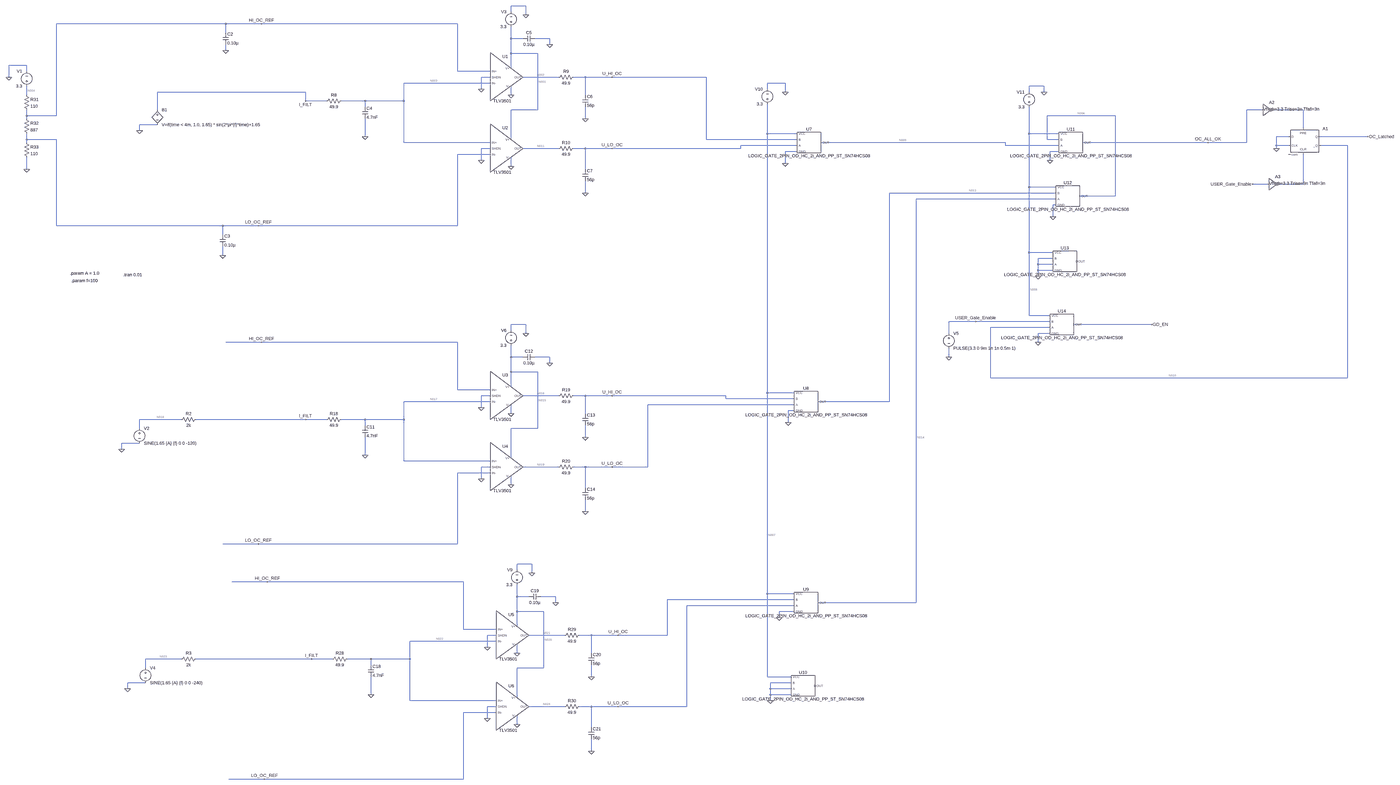
[diagram p0: schematic OvercurrentDetection.asc, whole sheet]
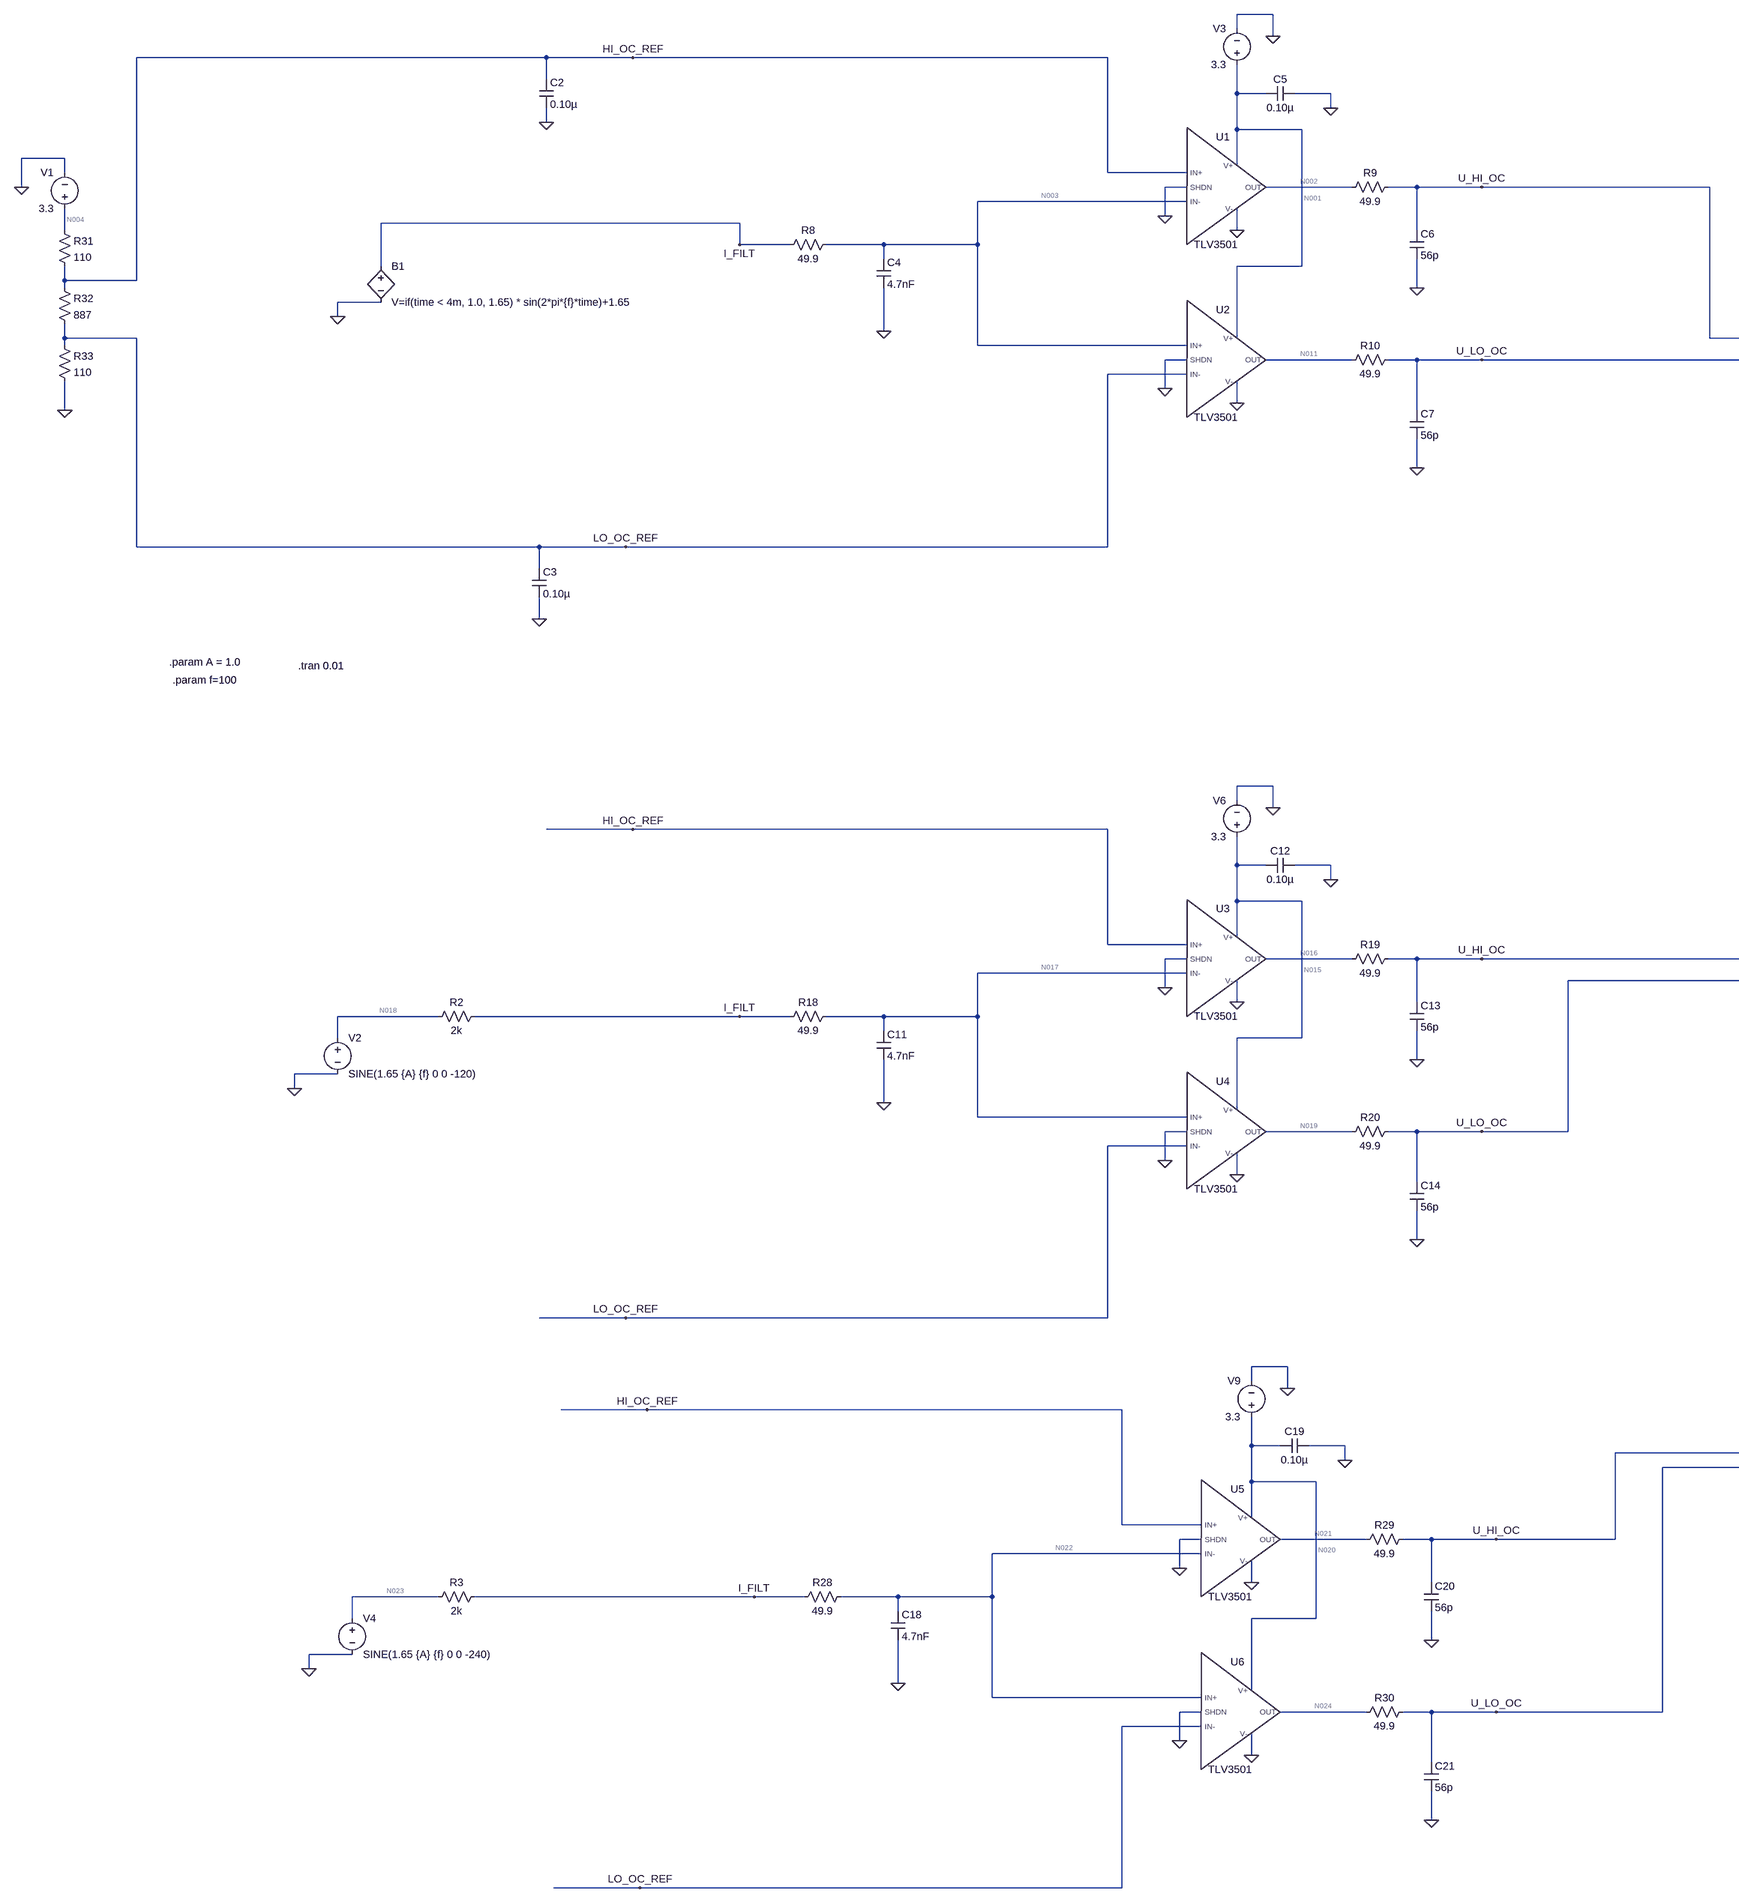
[diagram p1: schematic OvercurrentDetection.asc, part, row 1 of 1, column 1 of 2]
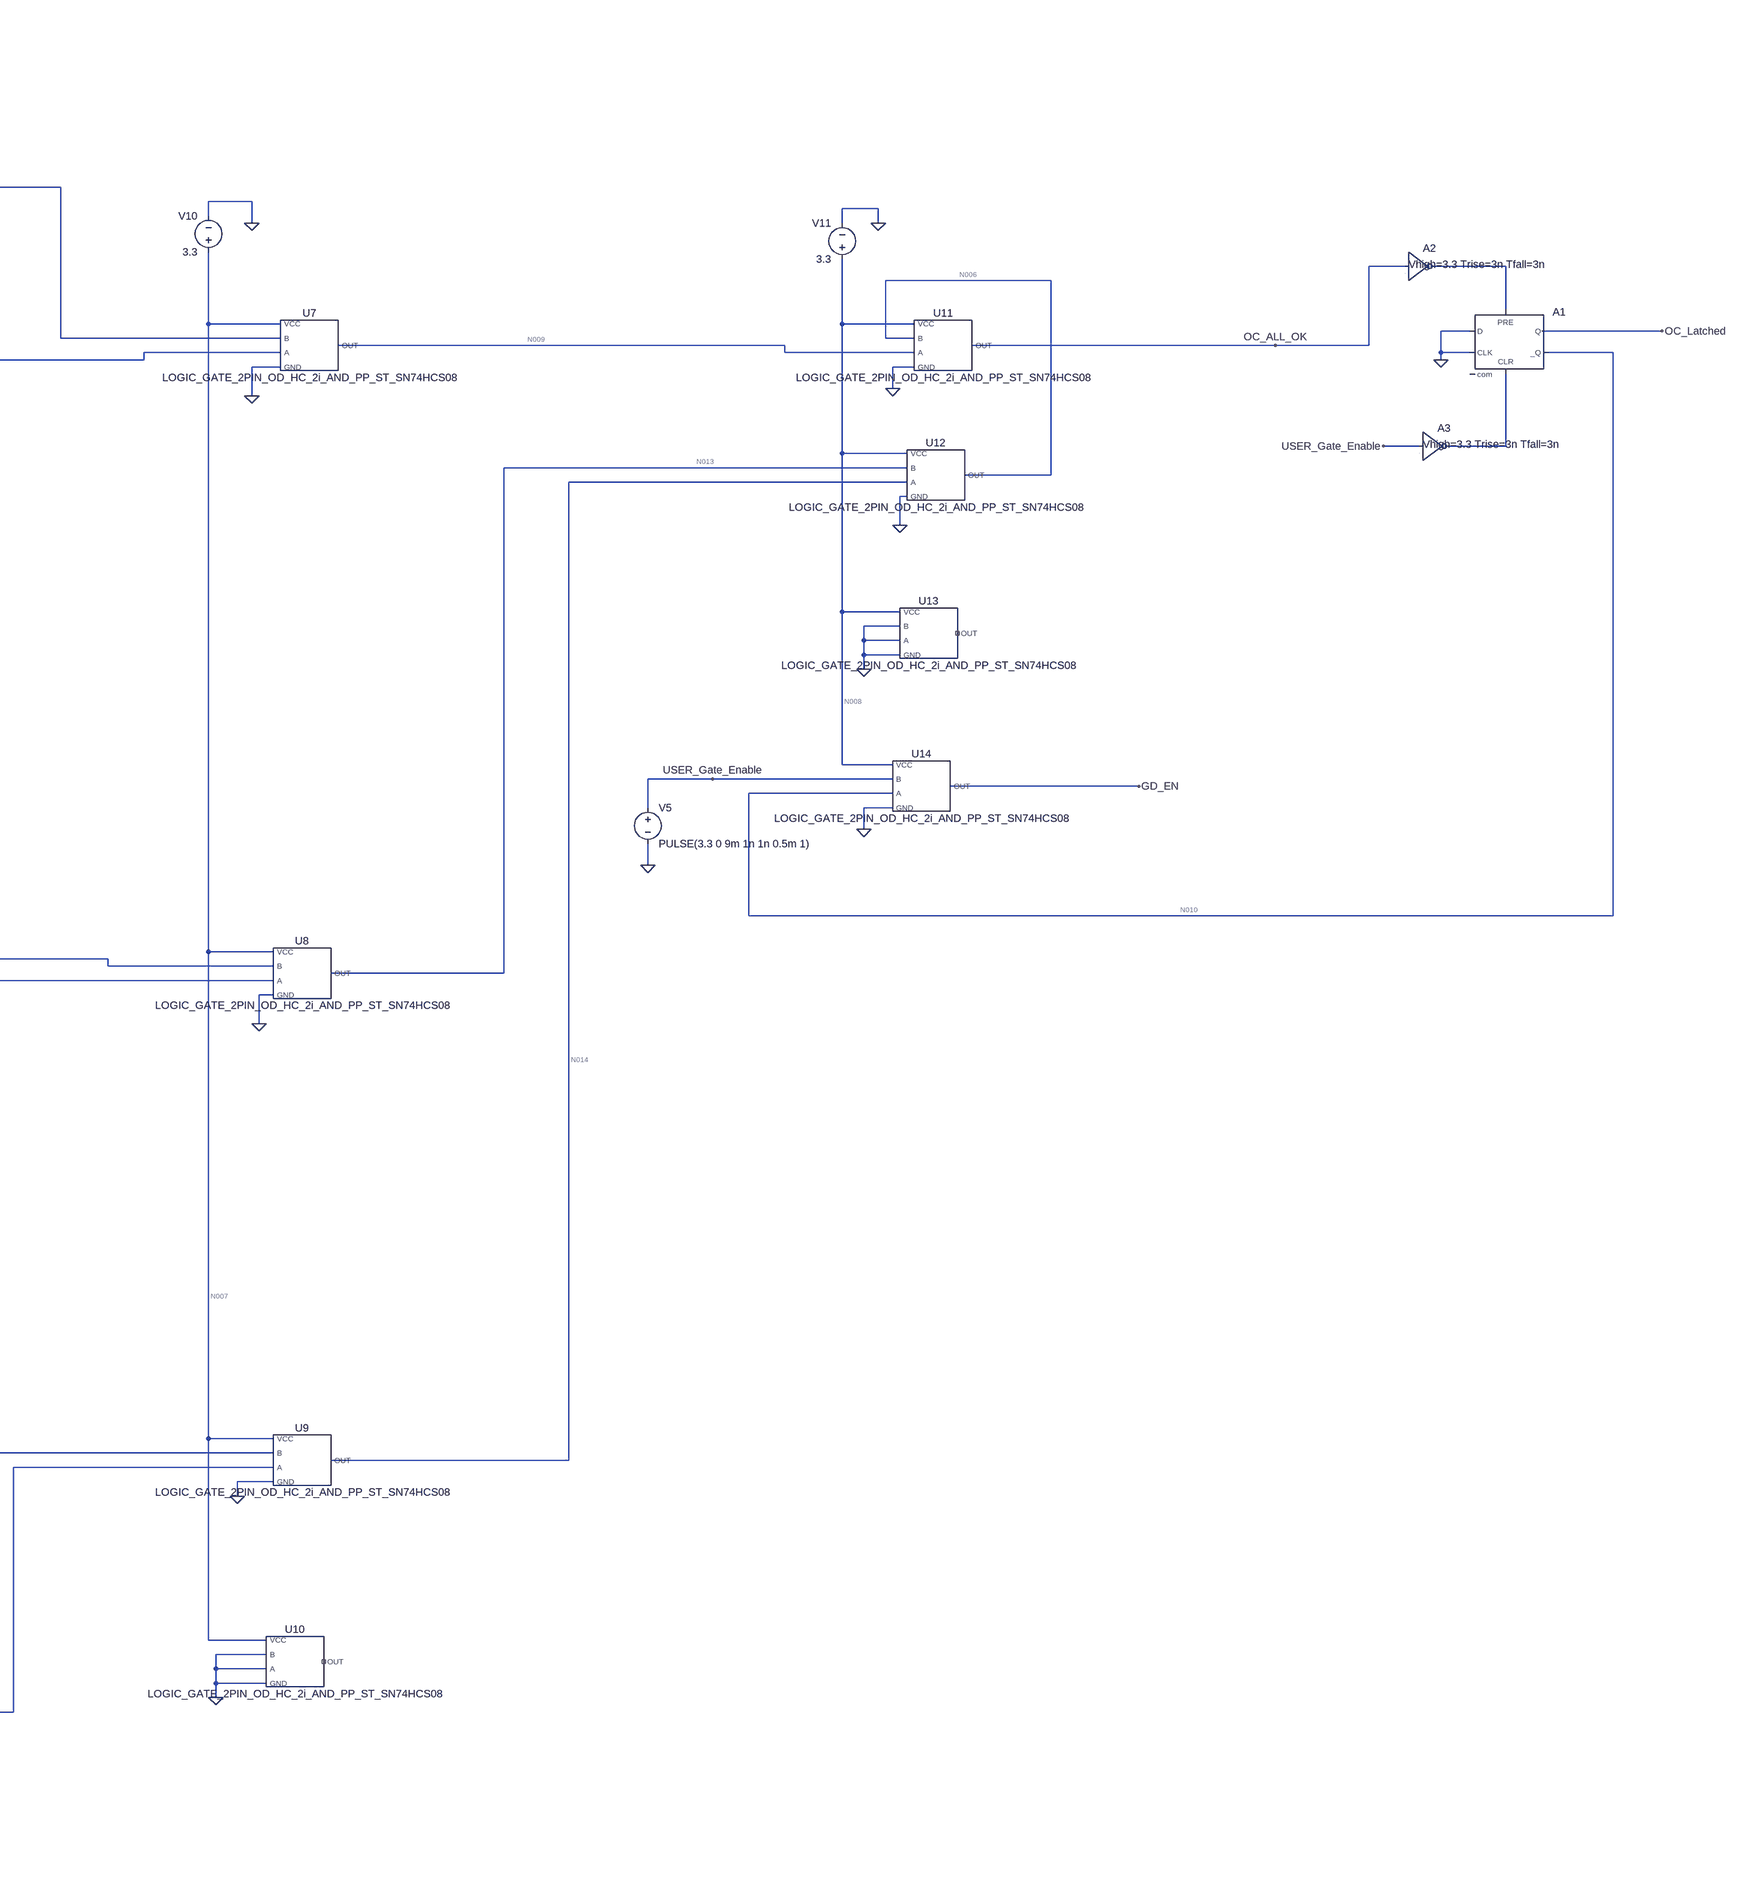
[diagram p2: schematic OvercurrentDetection.asc, part, row 1 of 1, column 2 of 2]
OvercurrentDetection.asc, the LTspice schematic file:
Version 4
SHEET 1 7980 4580
WIRE 2336 -384 2256 -384
WIRE 2256 -352 2256 -384
WIRE 2336 -336 2336 -384
WIRE 496 -288 -528 -288
WIRE 688 -288 496 -288
WIRE 1968 -288 688 -288
WIRE 496 -240 496 -288
WIRE 2256 -208 2256 -272
WIRE 2320 -208 2256 -208
WIRE 2464 -208 2384 -208
WIRE 2464 -176 2464 -208
WIRE 496 -144 496 -176
WIRE 2256 -128 2256 -208
WIRE 2400 -128 2256 -128
WIRE -688 -64 -784 -64
WIRE 2256 -48 2256 -128
WIRE -688 -32 -688 -64
WIRE 1968 -32 1968 -288
WIRE 2144 -32 1968 -32
WIRE -784 0 -784 -64
WIRE 2144 0 2096 0
WIRE 2512 0 2320 0
WIRE 2656 0 2592 0
WIRE 2800 0 2656 0
WIRE 3760 0 2800 0
WIRE 2144 32 1536 32
WIRE 4448 32 4352 32
WIRE 5952 48 5872 48
WIRE 2096 64 2096 0
WIRE 4352 64 4352 32
WIRE 944 80 128 80
WIRE 4448 80 4448 32
WIRE 5872 80 5872 48
WIRE 5952 80 5952 48
WIRE -688 96 -688 48
WIRE 2256 96 2256 48
WIRE 2656 96 2656 0
WIRE 944 128 944 80
WIRE 1056 128 944 128
WIRE 1264 128 1136 128
WIRE 1536 128 1536 32
WIRE 1536 128 1264 128
WIRE 1264 160 1264 128
WIRE 128 176 128 80
WIRE 2400 176 2400 -128
WIRE 2400 176 2256 176
WIRE 7216 176 7136 176
WIRE 7440 176 7280 176
WIRE -688 208 -688 176
WIRE -528 208 -528 -288
WIRE -528 208 -688 208
WIRE 6336 208 5968 208
WIRE -688 224 -688 208
WIRE 2656 224 2656 160
WIRE 128 256 32 256
WIRE 7440 272 7440 176
WIRE 32 288 32 256
WIRE 4352 304 4352 144
WIRE 4512 304 4352 304
WIRE 5872 304 5872 160
WIRE 6032 304 5872 304
WIRE 1264 320 1264 224
WIRE 7360 320 7296 320
WIRE 7824 320 7520 320
WIRE -688 336 -688 304
WIRE -528 336 -688 336
WIRE 2256 336 2256 176
WIRE 3760 336 3760 0
WIRE 4512 336 3760 336
WIRE 5968 336 5968 208
WIRE 6032 336 5968 336
WIRE -688 352 -688 336
WIRE 1536 352 1536 128
WIRE 2144 352 1536 352
WIRE 5744 352 4640 352
WIRE 6928 352 6160 352
WIRE 7136 352 7136 176
WIRE 7136 352 6928 352
WIRE 4512 368 4208 368
WIRE 5744 368 5744 352
WIRE 6032 368 5744 368
WIRE 7296 368 7296 320
WIRE 7360 368 7296 368
WIRE 7712 368 7536 368
WIRE 2144 384 2096 384
WIRE 2512 384 2320 384
WIRE 2656 384 2592 384
WIRE 2800 384 2656 384
WIRE 4208 384 4208 368
WIRE 4208 384 2800 384
WIRE 7296 384 7296 368
WIRE 4512 400 4448 400
WIRE 6032 400 5984 400
WIRE 2144 416 1968 416
WIRE 2096 448 2096 384
WIRE 5984 448 5984 400
WIRE 4448 464 4448 400
WIRE 2256 480 2256 432
WIRE -688 496 -688 432
WIRE 2656 496 2656 384
WIRE 7248 576 7168 576
WIRE 7440 576 7440 416
WIRE 7440 576 7312 576
WIRE 5872 592 5872 304
WIRE 6016 592 5872 592
WIRE 2656 624 2656 560
WIRE 6016 624 5120 624
WIRE 6336 640 6336 208
WIRE 6336 640 6144 640
WIRE 6016 656 5264 656
WIRE 6016 688 6000 688
WIRE 6000 752 6000 688
WIRE -528 800 -528 336
WIRE 480 800 -528 800
WIRE 672 800 480 800
WIRE 1968 800 1968 416
WIRE 1968 800 672 800
WIRE 480 848 480 800
WIRE 5872 944 5872 592
WIRE 6000 944 5872 944
WIRE 480 960 480 912
WIRE 6000 976 5920 976
WIRE 5920 1008 5920 976
WIRE 6000 1008 5920 1008
WIRE 5920 1040 5920 1008
WIRE 6000 1040 5920 1040
WIRE 5920 1072 5920 1040
WIRE 5872 1344 5872 944
WIRE 5984 1344 5872 1344
WIRE 5584 1376 5440 1376
WIRE 5984 1376 5584 1376
WIRE 2336 1392 2256 1392
WIRE 6576 1392 6112 1392
WIRE 5984 1408 5664 1408
WIRE 2256 1424 2256 1392
WIRE 2336 1440 2336 1392
WIRE 5440 1440 5440 1376
WIRE 5984 1440 5920 1440
WIRE 688 1488 496 1488
WIRE 1968 1488 688 1488
WIRE 5920 1488 5920 1440
WIRE 2256 1568 2256 1504
WIRE 2320 1568 2256 1568
WIRE 2464 1568 2384 1568
WIRE 5440 1568 5440 1520
WIRE 2464 1600 2464 1568
WIRE 2256 1648 2256 1568
WIRE 2400 1648 2256 1648
WIRE 5664 1680 5664 1408
WIRE 7712 1680 7712 368
WIRE 7712 1680 5664 1680
WIRE 2256 1728 2256 1648
WIRE 1968 1744 1968 1488
WIRE 2144 1744 1968 1744
WIRE 4352 1760 4352 304
WIRE 4496 1760 4352 1760
WIRE 2144 1776 2096 1776
WIRE 2512 1776 2320 1776
WIRE 2656 1776 2592 1776
WIRE 2800 1776 2656 1776
WIRE 4128 1776 2800 1776
WIRE 4128 1792 4128 1776
WIRE 4496 1792 4128 1792
WIRE 2144 1808 1536 1808
WIRE 5120 1808 5120 624
WIRE 5120 1808 4624 1808
WIRE 4496 1824 3152 1824
WIRE 2096 1840 2096 1776
WIRE 4496 1856 4464 1856
WIRE 2256 1872 2256 1824
WIRE 2656 1872 2656 1776
WIRE 256 1904 32 1904
WIRE 944 1904 336 1904
WIRE 1056 1904 944 1904
WIRE 1264 1904 1136 1904
WIRE 1536 1904 1536 1808
WIRE 1536 1904 1264 1904
WIRE 4464 1920 4464 1856
WIRE 1264 1936 1264 1904
WIRE 32 1952 32 1904
WIRE 2400 1952 2400 1648
WIRE 2400 1952 2256 1952
WIRE 2656 2000 2656 1936
WIRE 32 2032 -64 2032
WIRE -64 2064 -64 2032
WIRE 1264 2096 1264 2000
WIRE 2256 2112 2256 1952
WIRE 1536 2128 1536 1904
WIRE 2144 2128 1536 2128
WIRE 2144 2160 2096 2160
WIRE 2512 2160 2320 2160
WIRE 2656 2160 2592 2160
WIRE 2800 2160 2656 2160
WIRE 3152 2160 3152 1824
WIRE 3152 2160 2800 2160
WIRE 2144 2192 1968 2192
WIRE 2096 2224 2096 2160
WIRE 2256 2256 2256 2208
WIRE 2656 2272 2656 2160
WIRE 2656 2400 2656 2336
WIRE 672 2576 480 2576
WIRE 1968 2576 1968 2192
WIRE 1968 2576 672 2576
WIRE 2368 3136 2288 3136
WIRE 2288 3168 2288 3136
WIRE 2368 3184 2368 3136
WIRE 720 3232 528 3232
WIRE 2000 3232 720 3232
WIRE 4352 3296 4352 1760
WIRE 4496 3296 4352 3296
WIRE 2288 3312 2288 3248
WIRE 2352 3312 2288 3312
WIRE 2496 3312 2416 3312
WIRE 4496 3328 3360 3328
WIRE 2496 3344 2496 3312
WIRE 5264 3344 5264 656
WIRE 5264 3344 4624 3344
WIRE 4496 3360 3552 3360
WIRE 2288 3392 2288 3312
WIRE 2432 3392 2288 3392
WIRE 4496 3392 4416 3392
WIRE 4416 3424 4416 3392
WIRE 2288 3472 2288 3392
WIRE 2000 3488 2000 3232
WIRE 2176 3488 2000 3488
WIRE 2176 3520 2128 3520
WIRE 2544 3520 2352 3520
WIRE 2688 3520 2624 3520
WIRE 2832 3520 2688 3520
WIRE 3360 3520 3360 3328
WIRE 3360 3520 2832 3520
WIRE 2176 3552 1568 3552
WIRE 2128 3584 2128 3520
WIRE 2288 3616 2288 3568
WIRE 2688 3616 2688 3520
WIRE 256 3648 64 3648
WIRE 976 3648 336 3648
WIRE 1088 3648 976 3648
WIRE 1296 3648 1168 3648
WIRE 1568 3648 1568 3552
WIRE 1568 3648 1296 3648
WIRE 1296 3680 1296 3648
WIRE 64 3696 64 3648
WIRE 2432 3696 2432 3392
WIRE 2432 3696 2288 3696
WIRE 2688 3744 2688 3680
WIRE 4352 3744 4352 3296
WIRE 4480 3744 4352 3744
WIRE 64 3776 -32 3776
WIRE 4480 3776 4368 3776
WIRE -32 3808 -32 3776
WIRE 4368 3808 4368 3776
WIRE 4480 3808 4368 3808
WIRE 1296 3840 1296 3744
WIRE 4368 3840 4368 3808
WIRE 4480 3840 4368 3840
WIRE 2288 3856 2288 3696
WIRE 1568 3872 1568 3648
WIRE 2176 3872 1568 3872
WIRE 4368 3872 4368 3840
WIRE 2176 3904 2128 3904
WIRE 2544 3904 2352 3904
WIRE 2688 3904 2624 3904
WIRE 2832 3904 2688 3904
WIRE 3552 3904 3552 3360
WIRE 3552 3904 2832 3904
WIRE 2176 3936 2000 3936
WIRE 2128 3968 2128 3904
WIRE 2288 4000 2288 3952
WIRE 2688 4016 2688 3904
WIRE 2688 4144 2688 4080
WIRE 704 4320 512 4320
WIRE 2000 4320 2000 3936
WIRE 2000 4320 704 4320
FLAG 32 288 0
FLAG 672 800 LO_OC_REF
FLAG 688 -288 HI_OC_REF
FLAG 944 128 I_FILT
FLAG 1264 320 0
FLAG 2336 -336 0
FLAG 2464 -176 0
FLAG 2256 96 0
FLAG 2256 480 0
FLAG 2096 64 0
FLAG 2096 448 0
FLAG 2656 624 0
FLAG 2656 224 0
FLAG 2800 0 U_HI_OC
FLAG 2800 384 U_LO_OC
FLAG 672 2576 LO_OC_REF
FLAG 688 1488 HI_OC_REF
FLAG 944 1904 I_FILT
FLAG 1264 2096 0
FLAG 2336 1440 0
FLAG 2464 1600 0
FLAG 2256 1872 0
FLAG 2256 2256 0
FLAG 2096 1840 0
FLAG 2096 2224 0
FLAG 2656 2400 0
FLAG 2656 2000 0
FLAG 2800 1776 U_HI_OC
FLAG 2800 2160 U_LO_OC
FLAG 704 4320 LO_OC_REF
FLAG 720 3232 HI_OC_REF
FLAG 976 3648 I_FILT
FLAG 1296 3840 0
FLAG 2368 3184 0
FLAG 2496 3344 0
FLAG 2288 3616 0
FLAG 2288 4000 0
FLAG 2128 3584 0
FLAG 2128 3968 0
FLAG 2688 4144 0
FLAG 2688 3744 0
FLAG 2832 3520 U_HI_OC
FLAG 2832 3904 U_LO_OC
FLAG 4448 80 0
FLAG 4448 464 0
FLAG 4416 3424 0
FLAG 4368 3872 0
FLAG 5952 80 0
FLAG 5920 1072 0
FLAG 5920 1488 0
FLAG 6928 352 OC_ALL_OK
FLAG 4464 1920 0
FLAG 5984 448 0
FLAG 6000 752 0
FLAG -688 496 0
FLAG -784 0 0
FLAG 496 -144 0
FLAG 480 960 0
FLAG -64 2064 0
FLAG -32 3808 0
FLAG 7824 320 OC_Latched
FLAG 7296 384 0
FLAG 6576 1392 GD_EN
FLAG 5584 1376 USER_Gate_Enable
FLAG 7168 576 USER_Gate_Enable
FLAG 5440 1568 0
DATAFLAG 720 1472 ""
SYMBOL voltage -688 64 R180
WINDOW 0 24 96 Left 2
WINDOW 3 24 16 Left 2
WINDOW 123 0 0 Left 0
WINDOW 39 0 0 Left 0
SYMATTR InstName V1
SYMATTR Value 3.3
SYMBOL cap 480 -240 R0
SYMATTR InstName C2
SYMATTR Value 0.10µ
SYMATTR SpiceLine V=25
SYMBOL cap 464 848 R0
SYMATTR InstName C3
SYMATTR Value 0.10µ
SYMATTR SpiceLine V=25
SYMBOL res 1152 112 R90
WINDOW 0 0 56 VBottom 2
WINDOW 3 32 56 VTop 2
SYMATTR InstName R8
SYMATTR Value 49.9
SYMATTR SpiceLine pwr=0.1
SYMBOL cap 1248 160 R0
SYMATTR InstName C4
SYMATTR Value 4.7nF
SYMATTR SpiceLine V=50
SYMBOL TLV3501 2192 0 R0
SYMATTR InstName U1
SYMBOL TLV3501 2192 384 R0
SYMATTR InstName U2
SYMBOL voltage 2256 -256 R180
WINDOW 0 24 96 Left 2
WINDOW 3 24 16 Left 2
WINDOW 123 0 0 Left 0
WINDOW 39 0 0 Left 0
SYMATTR InstName V3
SYMATTR Value 3.3
SYMBOL cap 2384 -224 R90
WINDOW 0 0 32 VBottom 2
WINDOW 3 32 32 VTop 2
SYMATTR InstName C5
SYMATTR Value 0.10µ
SYMATTR SpiceLine V=25
SYMBOL res 2608 -16 R90
WINDOW 0 0 56 VBottom 2
WINDOW 3 32 56 VTop 2
SYMATTR InstName R9
SYMATTR Value 49.9
SYMATTR SpiceLine pwr=0.1
SYMBOL res 2608 368 R90
WINDOW 0 0 56 VBottom 2
WINDOW 3 32 56 VTop 2
SYMATTR InstName R10
SYMATTR Value 49.9
SYMATTR SpiceLine pwr=0.1
SYMBOL cap 2640 96 R0
SYMATTR InstName C6
SYMATTR Value 56p
SYMATTR SpiceLine V=50
SYMBOL cap 2640 496 R0
SYMATTR InstName C7
SYMATTR Value 56p
SYMATTR SpiceLine V=50
SYMBOL res 1152 1888 R90
WINDOW 0 0 56 VBottom 2
WINDOW 3 32 56 VTop 2
SYMATTR InstName R18
SYMATTR Value 49.9
SYMATTR SpiceLine pwr=0.1
SYMBOL cap 1248 1936 R0
SYMATTR InstName C11
SYMATTR Value 4.7nF
SYMATTR SpiceLine V=50
SYMBOL TLV3501 2192 1776 R0
SYMATTR InstName U3
SYMBOL TLV3501 2192 2160 R0
SYMATTR InstName U4
SYMBOL voltage 2256 1520 R180
WINDOW 0 24 96 Left 2
WINDOW 3 24 16 Left 2
WINDOW 123 0 0 Left 0
WINDOW 39 0 0 Left 0
SYMATTR InstName V6
SYMATTR Value 3.3
SYMBOL cap 2384 1552 R90
WINDOW 0 0 32 VBottom 2
WINDOW 3 32 32 VTop 2
SYMATTR InstName C12
SYMATTR Value 0.10µ
SYMATTR SpiceLine V=25
SYMBOL res 2608 1760 R90
WINDOW 0 0 56 VBottom 2
WINDOW 3 32 56 VTop 2
SYMATTR InstName R19
SYMATTR Value 49.9
SYMATTR SpiceLine pwr=0.1
SYMBOL res 2608 2144 R90
WINDOW 0 0 56 VBottom 2
WINDOW 3 32 56 VTop 2
SYMATTR InstName R20
SYMATTR Value 49.9
SYMATTR SpiceLine pwr=0.1
SYMBOL cap 2640 1872 R0
SYMATTR InstName C13
SYMATTR Value 56p
SYMATTR SpiceLine V=50
SYMBOL cap 2640 2272 R0
SYMATTR InstName C14
SYMATTR Value 56p
SYMATTR SpiceLine V=50
SYMBOL res 1184 3632 R90
WINDOW 0 0 56 VBottom 2
WINDOW 3 32 56 VTop 2
SYMATTR InstName R28
SYMATTR Value 49.9
SYMATTR SpiceLine pwr=0.1
SYMBOL cap 1280 3680 R0
SYMATTR InstName C18
SYMATTR Value 4.7nF
SYMATTR SpiceLine V=50
SYMBOL TLV3501 2224 3520 R0
SYMATTR InstName U5
SYMBOL TLV3501 2224 3904 R0
SYMATTR InstName U6
SYMBOL voltage 2288 3264 R180
WINDOW 0 24 96 Left 2
WINDOW 3 24 16 Left 2
WINDOW 123 0 0 Left 0
WINDOW 39 0 0 Left 0
SYMATTR InstName V9
SYMATTR Value 3.3
SYMBOL cap 2416 3296 R90
WINDOW 0 0 32 VBottom 2
WINDOW 3 32 32 VTop 2
SYMATTR InstName C19
SYMATTR Value 0.10µ
SYMATTR SpiceLine V=25
SYMBOL res 2640 3504 R90
WINDOW 0 0 56 VBottom 2
WINDOW 3 32 56 VTop 2
SYMATTR InstName R29
SYMATTR Value 49.9
SYMATTR SpiceLine pwr=0.1
SYMBOL res 2640 3888 R90
WINDOW 0 0 56 VBottom 2
WINDOW 3 32 56 VTop 2
SYMATTR InstName R30
SYMATTR Value 49.9
SYMATTR SpiceLine pwr=0.1
SYMBOL cap 2672 3616 R0
SYMATTR InstName C20
SYMATTR Value 56p
SYMATTR SpiceLine V=50
SYMBOL cap 2672 4016 R0
SYMATTR InstName C21
SYMATTR Value 56p
SYMATTR SpiceLine V=50
SYMBOL voltage 4352 160 R180
WINDOW 0 24 96 Left 2
WINDOW 3 24 16 Left 2
WINDOW 123 0 0 Left 0
WINDOW 39 0 0 Left 0
SYMATTR InstName V10
SYMATTR Value 3.3
SYMBOL voltage 5872 176 R180
WINDOW 0 24 96 Left 2
WINDOW 3 24 16 Left 2
WINDOW 123 0 0 Left 0
WINDOW 39 0 0 Left 0
SYMATTR InstName V11
SYMATTR Value 3.3
SYMBOL LOGIC_GATE_2PIN_OD_HC_2i_AND_PP_ST_SN74HCS08 4576 352 R0
SYMATTR InstName U7
SYMBOL LOGIC_GATE_2PIN_OD_HC_2i_AND_PP_ST_SN74HCS08 4560 1808 R0
SYMATTR InstName U8
SYMBOL LOGIC_GATE_2PIN_OD_HC_2i_AND_PP_ST_SN74HCS08 4544 3792 R0
SYMATTR InstName U10
SYMBOL LOGIC_GATE_2PIN_OD_HC_2i_AND_PP_ST_SN74HCS08 4560 3344 R0
SYMATTR InstName U9
SYMBOL LOGIC_GATE_2PIN_OD_HC_2i_AND_PP_ST_SN74HCS08 6096 352 R0
SYMATTR InstName U11
SYMBOL LOGIC_GATE_2PIN_OD_HC_2i_AND_PP_ST_SN74HCS08 6080 640 R0
SYMATTR InstName U12
SYMBOL LOGIC_GATE_2PIN_OD_HC_2i_AND_PP_ST_SN74HCS08 6064 992 R0
SYMATTR InstName U13
SYMBOL LOGIC_GATE_2PIN_OD_HC_2i_AND_PP_ST_SN74HCS08 6048 1392 R0
SYMATTR InstName U14
SYMBOL res -704 80 R0
SYMATTR InstName R31
SYMATTR Value 110
SYMBOL res -704 208 R0
SYMATTR InstName R32
SYMATTR Value 887
SYMBOL res -704 336 R0
SYMATTR InstName R33
SYMATTR Value 110
SYMBOL voltage 32 1936 R0
WINDOW 123 0 0 Left 0
WINDOW 39 0 0 Left 0
SYMATTR InstName V2
SYMATTR Value SINE(1.65 {A} {f} 0 0 -120)
SYMBOL voltage 64 3680 R0
WINDOW 123 0 0 Left 0
WINDOW 39 0 0 Left 0
SYMATTR InstName V4
SYMATTR Value SINE(1.65 {A} {f} 0 0 -240)
SYMBOL bv 128 160 R0
SYMATTR InstName B1
SYMATTR Value V=if(time < 4m, 1.0, 1.65) * sin(2*pi*{f}*time)+1.65
SYMBOL res 352 1888 R90
WINDOW 0 0 56 VBottom 2
WINDOW 3 32 56 VTop 2
SYMATTR InstName R2
SYMATTR Value 2k
SYMATTR SpiceLine pwr=0.1
SYMBOL res 352 3632 R90
WINDOW 0 0 56 VBottom 2
WINDOW 3 32 56 VTop 2
SYMATTR InstName R3
SYMATTR Value 2k
SYMATTR SpiceLine pwr=0.1
SYMBOL Digital\\dflop 7440 272 R0
WINDOW 3 0 0 Invisible 0
SYMATTR InstName A1
SYMATTR Value Vhigh=3.3 Td=4.5n Trise=3n Tfall=3n
SYMBOL Digital\\inv 7216 112 R0
WINDOW 3 8 60 Left 2
SYMATTR InstName A2
SYMATTR Value Vhigh=3.3 Trise=3n Tfall=3n
SYMBOL Digital\\inv 7248 512 R0
WINDOW 3 8 60 Left 2
SYMATTR InstName A3
SYMATTR Value Vhigh=3.3 Trise=3n Tfall=3n
SYMBOL voltage 5440 1424 R0
WINDOW 123 0 0 Left 0
WINDOW 39 0 0 Left 0
SYMATTR InstName V5
SYMATTR Value PULSE(3.3 0 9m 1n 1n 0.5m 1)
TEXT -56 1064 Left 2 !.tran 0.01
TEXT -456 1056 Left 2 !.param A = 1.0
TEXT -448 1096 Left 2 !.param f=100

The netlist it stands for:
* OvercurrentDetection.asc
V1 N004 0 3.3
C2 HI_OC_REF 0 0.10µ V=25
C3 LO_OC_REF 0 0.10µ V=25
R8 N003 I_FILT 49.9 pwr=0.1
C4 N003 0 4.7nF V=50
XU1 HI_OC_REF N003 0 N001 0 N002 TLV3501  ; pins IN+ IN- SHDN V+ V- OUT
XU2 N003 LO_OC_REF 0 N001 0 N011 TLV3501  ; pins IN+ IN- SHDN V+ V- OUT
V3 N001 0 3.3
C5 0 N001 0.10µ V=25
R9 U_HI_OC N002 49.9 pwr=0.1
R10 U_LO_OC N011 49.9 pwr=0.1
C6 U_HI_OC 0 56p V=50
C7 U_LO_OC 0 56p V=50
R18 N017 I_FILT 49.9 pwr=0.1
C11 N017 0 4.7nF V=50
XU3 HI_OC_REF N017 0 N015 0 N016 TLV3501  ; pins IN+ IN- SHDN V+ V- OUT
XU4 N017 LO_OC_REF 0 N015 0 N019 TLV3501  ; pins IN+ IN- SHDN V+ V- OUT
V6 N015 0 3.3
C12 0 N015 0.10µ V=25
R19 U_HI_OC N016 49.9 pwr=0.1
R20 U_LO_OC N019 49.9 pwr=0.1
C13 U_HI_OC 0 56p V=50
C14 U_LO_OC 0 56p V=50
R28 N022 I_FILT 49.9 pwr=0.1
C18 N022 0 4.7nF V=50
XU5 HI_OC_REF N022 0 N020 0 N021 TLV3501  ; pins IN+ IN- SHDN V+ V- OUT
XU6 N022 LO_OC_REF 0 N020 0 N024 TLV3501  ; pins IN+ IN- SHDN V+ V- OUT
V9 N020 0 3.3
C19 0 N020 0.10µ V=25
R29 U_HI_OC N021 49.9 pwr=0.1
R30 U_LO_OC N024 49.9 pwr=0.1
C20 U_HI_OC 0 56p V=50
C21 U_LO_OC 0 56p V=50
V10 N007 0 3.3
V11 N008 0 3.3
XU7 N009 U_LO_OC U_HI_OC N007 0 LOGIC_GATE_2PIN_OD_HC_2i_AND_PP_ST_SN74HCS08  ; pins OUT A B VCC GND
XU8 N013 U_LO_OC U_HI_OC N007 0 LOGIC_GATE_2PIN_OD_HC_2i_AND_PP_ST_SN74HCS08  ; pins OUT A B VCC GND
XU10 NC_01 0 0 N007 0 LOGIC_GATE_2PIN_OD_HC_2i_AND_PP_ST_SN74HCS08  ; pins OUT A B VCC GND
XU9 N014 U_LO_OC U_HI_OC N007 0 LOGIC_GATE_2PIN_OD_HC_2i_AND_PP_ST_SN74HCS08  ; pins OUT A B VCC GND
XU11 OC_ALL_OK N009 N006 N008 0 LOGIC_GATE_2PIN_OD_HC_2i_AND_PP_ST_SN74HCS08  ; pins OUT A B VCC GND
XU12 N006 N014 N013 N008 0 LOGIC_GATE_2PIN_OD_HC_2i_AND_PP_ST_SN74HCS08  ; pins OUT A B VCC GND
XU13 NC_02 0 0 N008 0 LOGIC_GATE_2PIN_OD_HC_2i_AND_PP_ST_SN74HCS08  ; pins OUT A B VCC GND
XU14 GD_EN N010 USER_Gate_Enable N008 0 LOGIC_GATE_2PIN_OD_HC_2i_AND_PP_ST_SN74HCS08  ; pins OUT A B VCC GND
R31 N004 HI_OC_REF 110
R32 HI_OC_REF LO_OC_REF 887
R33 LO_OC_REF 0 110
V2 N018 0 SINE(1.65 {A} {f} 0 0 -120)
V4 N023 0 SINE(1.65 {A} {f} 0 0 -240)
B1 I_FILT 0 V=if(time < 4m, 1.0, 1.65) * sin(2*pi*{f}*time)+1.65
R2 I_FILT N018 2k pwr=0.1
R3 I_FILT N023 2k pwr=0.1
A1 0 0 0 N005 N012 N010 OC_Latched 0 DFLOP Vhigh=3.3 Td=4.5n Trise=3n Tfall=3n
A2 OC_ALL_OK 0 0 0 0 N005 0 0 BUF Vhigh=3.3 Trise=3n Tfall=3n
A3 USER_Gate_Enable 0 0 0 0 N012 0 0 BUF Vhigh=3.3 Trise=3n Tfall=3n
V5 USER_Gate_Enable 0 PULSE(3.3 0 9m 1n 1n 0.5m 1)
.tran 0.01
.param A = 1.0
.param f=100
.lib tlv3501.lib
.lib SN74HCS08.cir
.backanno
.end

* Results of the author's LTspice run, read from the files saved beside the schematic
* Operating Point, zero values left out:
*   V(n004) = 3.3 V
*   V(hi_oc_ref) = 2.972 V
*   V(lo_oc_ref) = 327.9 mV
*   V(n003) = 1.65 V
*   V(i_filt) = 1.65 V
*   V(n001) = 3.3 V
*   V(n002) = 3.3 V
*   V(n011) = 3.3 V
*   V(u_hi_oc) = 3.3 V
*   V(u_lo_oc) = 3.3 V
*   V(n017) = 1.65 V
*   V(n015) = 3.3 V
*   V(n016) = 3.3 V
*   V(n019) = 3.3 V
*   V(n022) = 1.65 V
*   V(n020) = 3.3 V
*   V(n021) = 3.3 V
*   V(n024) = 3.3 V
*   V(n007) = 3.3 V
*   V(n008) = 3.3 V
*   V(n009) = 3.295 V
*   V(n013) = 3.295 V
*   V(n014) = 3.295 V
*   V(n006) = 3.295 V
*   V(oc_all_ok) = 3.298 V
*   V(n010) = 3.3 V
*   V(user_gate_enable) = 3.3 V
*   V(gd_en) = 3.298 V
*   V(n018) = 784 mV
*   V(n023) = 2.516 V
*   I(B1) = -12 pA
*   I(R8) = -4 pA
*   I(R9) = -3.313 µA
*   I(R10) = -3.313 µA
*   I(R18) = -4 pA
*   I(R19) = -3.313 µA
*   I(R20) = -3.313 µA
*   I(R28) = -4 pA
*   I(R29) = -3.313 µA
*   I(R30) = -3.313 µA
*   I(R31) = 2.981 mA
*   I(R32) = 2.981 mA
*   I(R33) = 2.981 mA
*   I(R2) = 433 µA
*   I(R3) = -433 µA
*   I(V1) = -2.981 mA
*   I(V3) = -6.407 mA
*   I(V6) = -6.407 mA
*   I(V9) = -6.407 mA
*   I(V10) = -20.13 µA
*   I(V11) = -13.52 µA
*   I(V2) = 433 µA
*   I(V4) = -433 µA
*   I(V5) = -3.314 µA
*   I8(A1) = 3.314 µA
*   I6(A1) = -3.314 µA
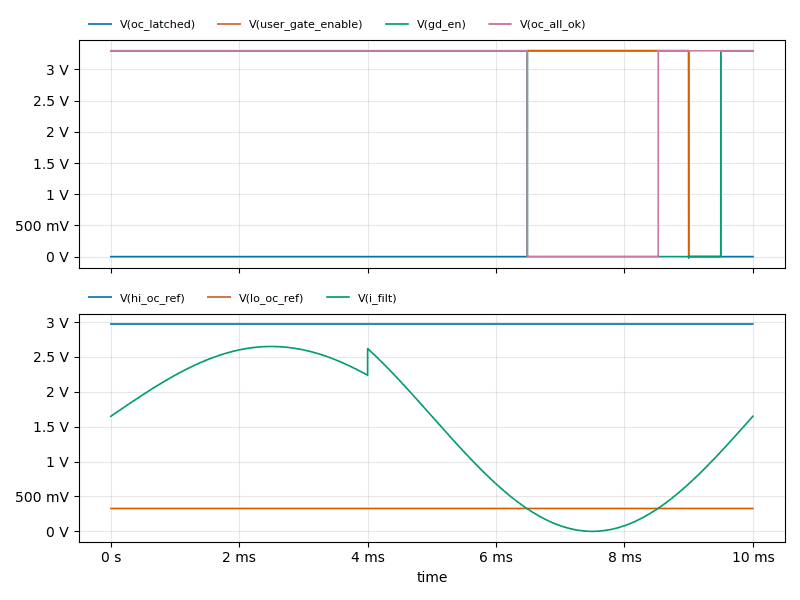
[diagram p3: Transient Analysis of OvercurrentDetection.asc, plotted from the saved traces]
* Transient Analysis, 1 run:
*   V(oc_latched): min -23.02 mV, max 3.3 V, average 829.6 mV, rms 1.655 V, last 0 V
*   V(user_gate_enable): min 0 V, max 3.3 V, average 3.135 V, rms 3.216 V, last 3.3 V
*   V(gd_en): min 0 V, max 3.298 V, average 2.304 V, rms 2.756 V, last 3.298 V
*   V(oc_all_ok): min 0 V, max 3.298 V, average 2.625 V, rms 2.942 V, last 3.298 V
*   V(hi_oc_ref): min 2.972 V, max 2.972 V, average 2.972 V, rms 2.972 V, last 2.972 V
*   V(lo_oc_ref): min 327.9 mV, max 327.9 mV, average 327.9 mV, rms 327.9 mV, last 327.9 mV
*   V(i_filt): min 0 V, max 2.65 V, average 1.463 V, rms 1.748 V, last 1.65 V